# EAGLE design CWGenerator (EAGLE 8.6.0)
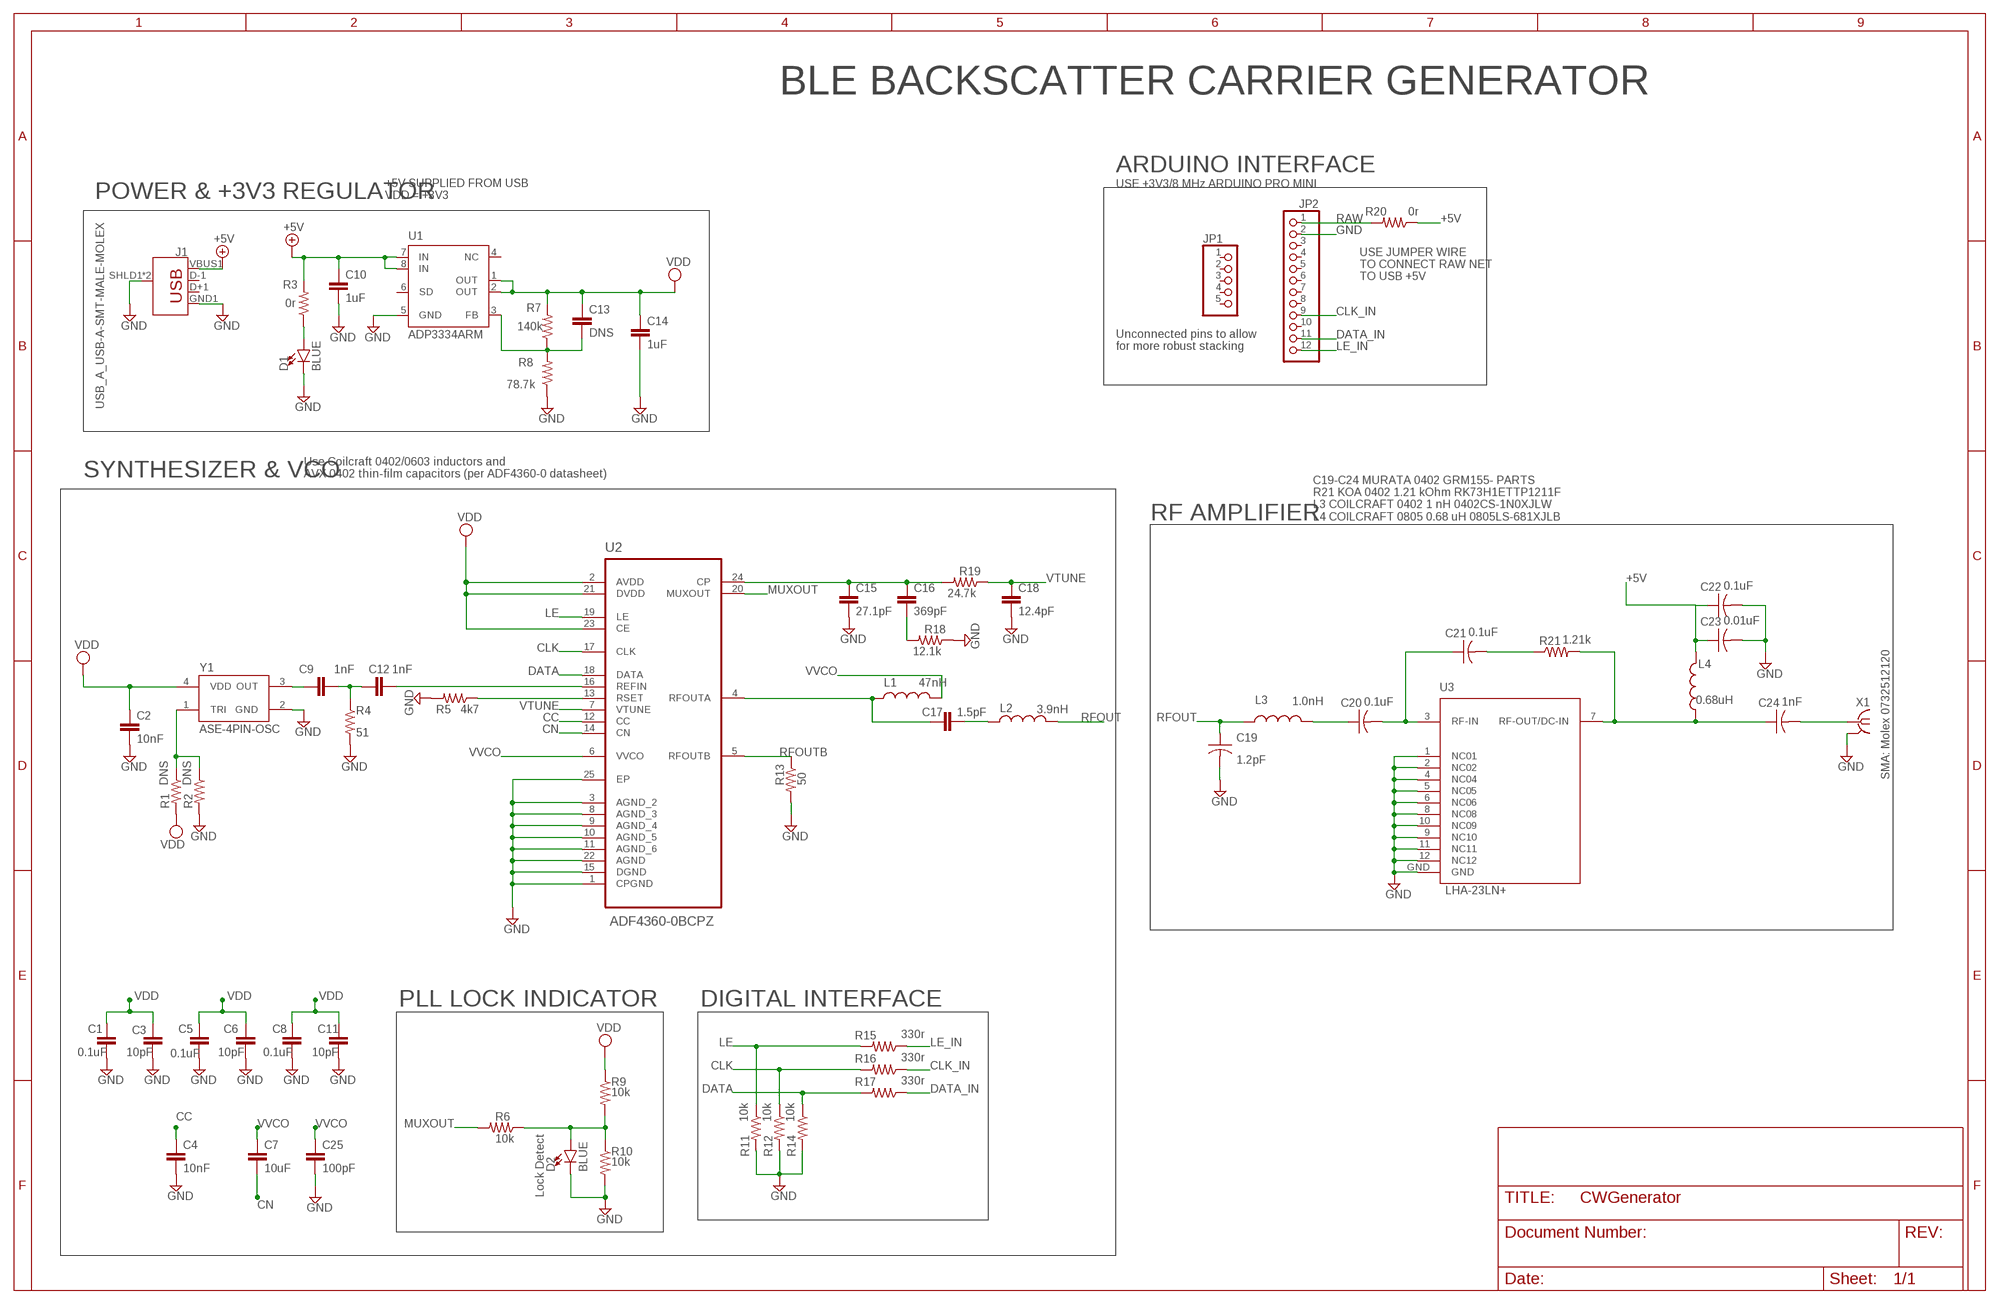
[diagram p0: schematic, sheet 1]

## Parts
C1  0.1uF  C-EUC0402  [C0402]
C2  10nF  C-EUC0402  [C0402]
C3  10pF  C-EUC0402  [C0402]
C4  10nF  C-EUC0402  [C0402]
C5  0.1uF  C-EUC0402  [C0402]
C6  10pF  C-EUC0402  [C0402]
C7  10uF  C-EUC0402  [C0402]
C8  0.1uF  C-EUC0402  [C0402]
C9  1nF  C-EUC0402  [C0402]
C10  1uF  C-EUC0402  [C0402]
C11  10pF  C-EUC0402  [C0402]
C12  1nF  C-EUC0402  [C0402]
C13  DNS  C-EUC0402  [C0402]
C14  1uF  C-EUC0402  [C0402]
C15  27.1pF  C-EUC0402  [C0402]
C16  369pF  C-EUC0402  [C0402]
C17  1.5pF  C-EUC0402  [C0402]
C18  12.4pF  C-EUC0402  [C0402]
C19  1.2pF  C-USC0402  [C0402]
C20  0.1uF  C-USC0402  [C0402]
C21  0.1uF  C-USC0402  [C0402]
C22  0.1uF  C-USC0402  [C0402]
C23  0.01uF  C-USC0402  [C0402]
C24  1nF  C-USC0402  [C0402]
C25  100pF  C-EUC0402  [C0402]
D1  BLUE  LED-BLUE0603  [LED-0603]
D2  BLUE  LED-BLUE0603  [LED-0603]
J1  USB_A_USB-A-SMT-MALE-MOLEX  [USB-A-SMT-MALE-MOLEX]
JP1  PINHD-1X5  [1X05]
JP2  PINHD-1X12  [1X12]
L1  47nH  L-USL0402  [C0402]
L2  3.9nH  L-USL0402  [C0402]
L3  1.0nH  L-USL0402  [C0402]
L4  0.68uH  L-USL0805  [R0805]
R1  DNS  R-US_R0402  [R0402]
R2  DNS  R-US_R0402  [R0402]
R3  0r  R-US_R0402  [R0402]
R4  51  R-US_R0402  [R0402]
R5  4k7  R-US_R0402  [R0402]
R6  10k  R-US_R0402  [R0402]
R7  140k  R-US_R0402  [R0402]
R8  78.7k  R-US_R0402  [R0402]
R9  10k  R-US_R0402  [R0402]
R10  10k  R-US_R0402  [R0402]
R11  10k  R-US_R0402  [R0402]
R12  10k  R-US_R0402  [R0402]
R13  50  R-US_R0402  [R0402]
R14  10k  R-US_R0402  [R0402]
R15  330r  R-US_R0402  [R0402]
R16  330r  R-US_R0402  [R0402]
R17  330r  R-US_R0402  [R0402]
R18  12.1k  R-US_R0402  [R0402]
R19  24.7k  R-US_R0402  [R0402]
R20  0r  R-US_R0402  [R0402]
R21  1.21k  R-US_R0402  [R0402]
U1  ADP3334ARM  [MSOP08]
U2  ADF4360-0BCPZ  [QFN50P400X400X100-25N]
U3  LHA-23LN+  [MCLP]
X1  SMA-142-0711-821/826  [J502-ND-142-0711-821/826]
Y1  ASE-4PIN-OSC  [3.2X2.5MM]

## Nets
+5V: C10.1 C22.1 C23.1 J1.VBUS1(VBUS) L4.2 R3.2 R20.1 U1.7(IN) U1.8(IN)
CC: C4.1 U2.12(CC)
CLK: R12.1 R16.2 U2.17(CLK)
CLK_IN: JP2.9 R16.1
CN: C7.2 U2.14(CN)
DATA: R14.1 R17.2 U2.18(DATA)
DATA_IN: JP2.11 R17.1
GND: C1.2 C2.2 C3.2 C4.2 C5.2 C6.2 C8.2 C10.2 C11.2 C14.2 C15.2 C18.2 C19.2 C22.2 C23.2 C25.2 D1.C D2.C J1.GND1(GND) J1.SHLD1(SHIELD) J1.SHLD2(SHIELD) JP2.2 R2.2 R4.2 R5.2 R8.1 R10.2 R11.2 R12.2 R13.2 R14.2 R18.1 U1.5(GND) U2.1(CPGND) U2.3(AGND_2) U2.8(AGND_3) U2.9(AGND_4) U2.10(AGND_5) U2.11(AGND_6) U2.15(DGND) U2.22(AGND) U2.25(EP) U3.1(NC01) U3.2(NC02) U3.4(NC04) U3.5(NC05) U3.6(NC06) U3.8(NC08) U3.9(NC10) U3.10(NC09) U3.11(NC11) U3.12(NC12) U3.GND X1.G@1 X1.G@2 X1.G@3 X1.G@4 Y1.2(GND)
LE: R11.1 R15.2 U2.19(LE)
LE_IN: JP2.12 R15.1
MUXOUT: R6.2 U2.20(MUXOUT)
N$1: D1.A R3.1
N$2: C20.1 L3.2
N$3: C20.2 C21.1 U3.3(RF-IN)
N$4: C21.2 R21.1
N$5: C24.1 L4.1 R21.2 U3.7(RF-OUT/DC-IN)
N$6: C13.2 R7.1 R8.2 U1.3(FB)
N$7: R5.1 U2.13(RSET)
N$10: C17.2 L2.1
N$12: C15.1 C16.1 R19.2 U2.24(CP)
N$13: C16.2 R18.2
N$15: C12.2 U2.16(REFIN)
N$17: C9.2 C12.1 R4.1
N$19: D2.A R6.1 R9.2 R10.1
N$20: C24.2 X1.1
N$23: C9.1 Y1.3(OUT)
N$24: R1.1 R2.1 Y1.1(TRI)
RAW: JP2.1 R20.2
RFOUT: C19.1 L2.2 L3.1
RFOUTA: C17.1 L1.1 U2.4(RFOUTA)
RFOUTB: R13.1 U2.5(RFOUTB)
VDD: C1.1 C2.1 C3.1 C5.1 C6.1 C8.1 C11.1 C13.1 C14.1 R1.2 R7.2 R9.1 U1.1(OUT) U1.2(OUT) U2.2(AVDD) U2.21(DVDD) U2.23(CE) Y1.4(VDD)
VTUNE: C18.1 R19.1 U2.7(VTUNE)
VVCO: C7.1 C25.1 L1.2 U2.6(VVCO)
Unconnected: J1.D+1(D+) J1.D-1(D-) JP1.1 JP1.2 JP1.3 JP1.4 JP1.5 JP2.3 JP2.4 JP2.5 JP2.6 JP2.7 JP2.8 JP2.10 U1.4(NC) U1.6(SD)

## Notes on the sheet
- BLE BACKSCATTER CARRIER GENERATOR
- ARDUINO INTERFACE
- USE +3V3/8 MHz ARDUINO PRO MINI
- POWER & +3V3 REGULATOR
- +5V SUPPLIED FROM USB
  VDD = +3V3
- USE JUMPER WIRE
  TO CONNECT RAW NET
  TO USB +5V
- Unconnected pins to allow
  for more robust stacking
- SYNTHESIZER & VCO
- Use Coilcraft 0402/0603 inductors and 
  AVX 0402 thin-film capacitors (per ADF4360-0 datasheet)
- RF AMPLIFIER
- C19-C24 MURATA 0402 GRM155- PARTS
  R21 KOA 0402 1.21 kOhm RK73H1ETTP1211F
  L3 COILCRAFT 0402 1 nH 0402CS-1N0XJLW
  L4 COILCRAFT 0805 0.68 uH 0805LS-681XJLB
- SMA: Molex 0732512120
- PLL LOCK INDICATOR | DIGITAL INTERFACE
- Lock Detect

## Library data of the parts
C1-C18 C25 = rcl:C-EU: CAPACITOR, European symbol; SPICEPREFIX: C
C19-C24 = rcl:C-US: CAPACITOR, American symbol; SPICEPREFIX: C
D1 D2 = SparkFun-LED:LED-BLUE: Blue SMD LED Used in manufacturing of various products at SparkFun Packages: 0603 - SMD 0603 package [Product Link] <http://www.digikey.com/product-detail/en/SMLE12BC7TT86/511-1589-2-ND/1641808> 1206 - SMD1206 package [Product Link] <http://www.digikey.com/product-detail/en/lite-on-inc/LTST-C150TBKT/160-1643-1-ND/573584> SparkFun Products: ESP8266 Thing-Dev Board <https://www.sparkfun.com/products/13711> RedBoard <https://www.sparkfun.com/products/12757>; PROD_ID: DIO-08575
J1 = SparkFun-Connectors:USB_A: USB-A Connector Male and female variants, as well as PTH and SMT variants SparkFun Products: SparkFun XBee Explorer Dongle <https://www.sparkfun.com/products/11697> PTH Male SparkFun MicroView-USB Programmer <https://www.sparkfun.com/products/12924> SMT Male SparkFun USB Type A Female Breakout <https://www.sparkfun.com/products/12700> SMT Female
JP1 = pinhead:PINHD-1X5: PIN HEADER
JP2 = pinhead:PINHD-1X12: PIN HEADER
L1-L4 = rcl:L-US: INDUCTOR, American symbol
R1-R21 = rcl:R-US_: RESISTOR, American symbol; SPICEPREFIX: R
U1 = analog-devices:ADP3334: http://www.analog.com/media/en/technical-documentation/data-sheets/ADP3334.pdf
U2 = ADI-Phase-2:ADF4360-0BCPZ: Integrated Synthesizer and VCO; MPN: ADF4360-0BCPZ; OC_FARNELL: unknown; OC_NEWARK: 59K1097; PACKAGE: LFCSP-24; SUPPLIER: Analog Devices
U3 = minicircuits:LHA-23LN+: Description: Wideband amplifier 30 MHz to 2 GHz https://www.minicircuits.com/pdfs/LHA-23LN+.pdf
X1 = con-coax:SMA-: SMA 50 Ohm End Launch Jack Receptacle - Round Contact Johnson Components Source: www.johnsoncomponents.com .. J502-ND.pdf; MF: JOHNSON COMPONENTS; MPN: 142-0711-821; OC_FARNELL: 1019328; OC_NEWARK: 16F3627
Y1 = abracon:ASE-4PIN-OSC

## Board
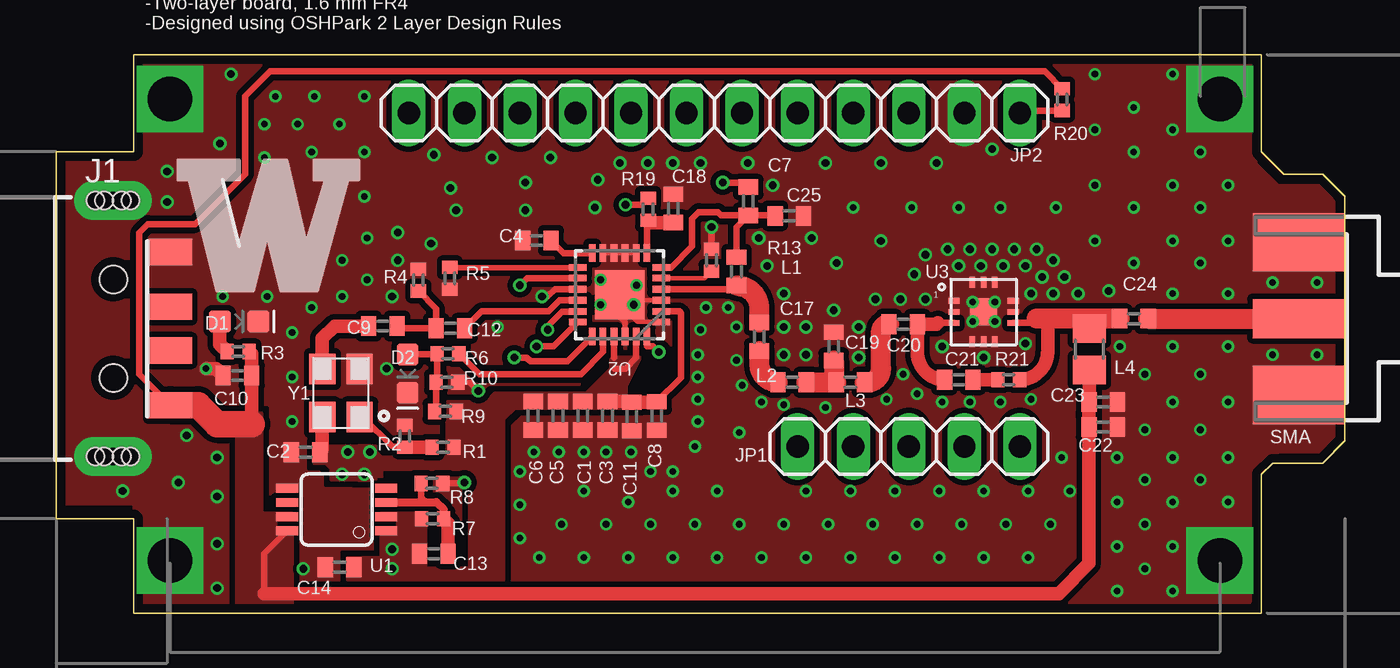
[diagram p1: board, top side]
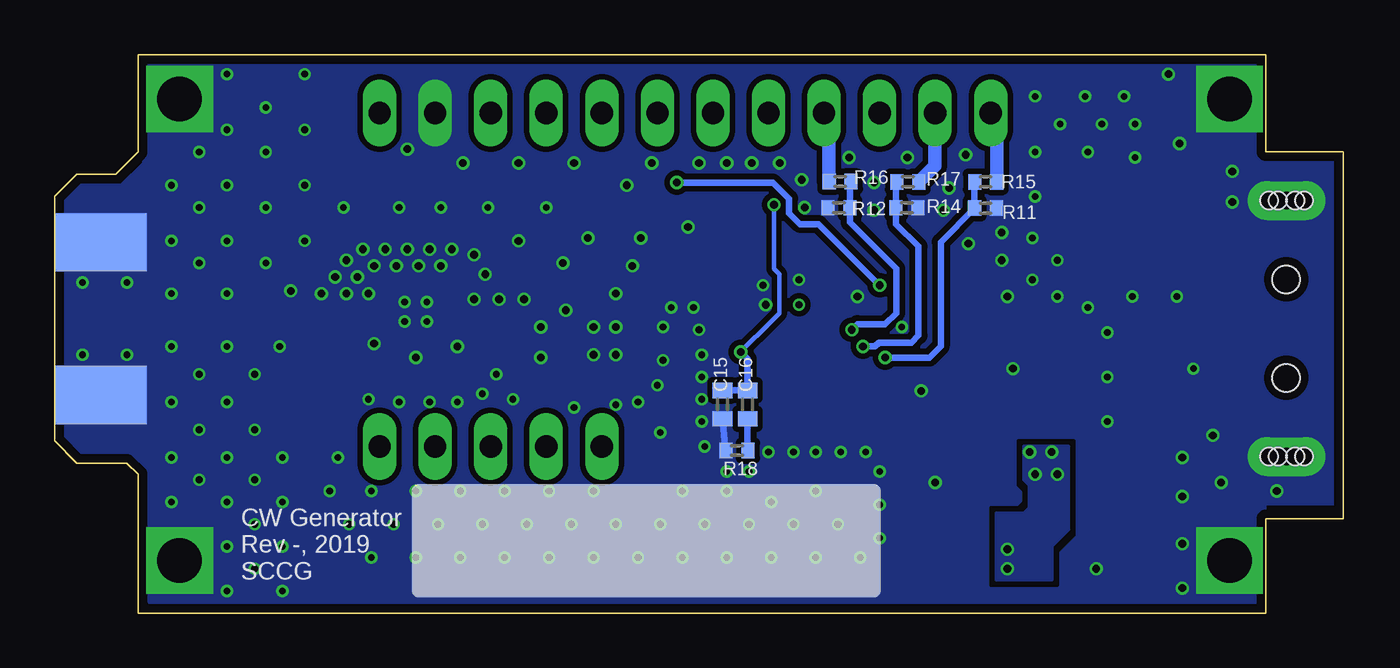
[diagram p2: board, bottom side, seen from below]

Size 58.93 x 25.53 mm. Coordinates in mm from the lower left corner, seen from the top.
Outline: 55.12,25.53 3.56,25.53 3.56,21.08 0,21.08 0,4.32 3.56,4.32 3.56,0 55.12,0 55.12,6.35 55.63,6.86 57.91,6.86 58.93,7.87 58.93,19.05 57.91,20.07 56.13,20.07 55.12,21.08 55.12,25.53
Copper layers (1*16): Top 0.035559375mm / dielectric 1.6mm / Bottom 0.035559375mm
Design rules "oshpark2layer *": minimum track width 6mil, minimum drill 10mil, track to track 6mil, track to pad 6mil, pad to pad 6mil, via to via 6mil, smd to smd 6mil, copper to edge 15mil, drill to drill 6mil, minimum pad ring 5mil, minimum via ring 5mil, stop-mask expansion 2.5mil, vias tented up to drill 18mil, thermal gap 10mil

### Footprints (pad centres in the part's own frame; a part is rotated, then mirrored left to right if it is on the bottom)
C0402 = smd 0.7 x 0.9: 1 -0.65,0; 2 0.65,0
LED-0603 = smd 1 x 1: A -0.877,0; C 0.877,0
USB-A-SMT-MALE-MOLEX = smd 2 x 1.2: D+1 5.35,1; D-1 5.35,-1; GND1 5.35,3.5; VBUS1 5.35,-3.5 | drill 0.8 pad 1.778 long: SHLD1 2.73,-5.85; SHLD2 2.73,5.85 | hole 1.25: 2.75,2.25; 2.75,-2.25 | hole 0.8: 3.13,-5.85; 3.53,-5.85; 2.33,-5.85; 1.93,-5.85; 3.13,5.85; 3.53,5.85; 2.33,5.85; 1.93,5.85
1X05 = drill 1.016 long: 1 -5.08,0; 2 -2.54,0; 3 0,0; 4 2.54,0; 5 5.08,0
1X12 = drill 1.016 long: 1 -13.97,0; 2 -11.43,0; 3 -8.89,0; 4 -6.35,0; 5 -3.81,0; 6 -1.27,0; 7 1.27,0; 8 3.81,0; 9 6.35,0; 10 8.89,0; 11 11.43,0; 12 13.97,0
R0805 = smd 1.3 x 1.5: 1 -0.95,0; 2 0.95,0
R0402 = smd 0.6 x 0.7: 1 -0.5,0; 2 0.5,0
MSOP08 = smd 0.4 x 1: 1 -0.976,-2.263; 2 -0.326,-2.263; 3 0.324,-2.263; 4 0.974,-2.263; 5 0.974,2.262; 6 0.324,2.262; 7 -0.326,2.262; 8 -0.976,2.262
QFN50P400X400X100-25N = smd 0.813 x 0.305: 1 -1.905,1.245; 2 -1.905,0.762; 3 -1.905,0.254; 4 -1.905,-0.254; 5 -1.905,-0.762; 6 -1.905,-1.245; 13 1.905,-1.245; 14 1.905,-0.762; 15 1.905,-0.254; 16 1.905,0.254; 17 1.905,0.762; 18 1.905,1.245 | smd 0.305 x 0.813: 7 -1.245,-1.905; 8 -0.762,-1.905; 9 -0.254,-1.905; 10 0.254,-1.905; 11 0.762,-1.905; 12 1.245,-1.905; 19 1.245,1.905; 20 0.762,1.905; 21 0.254,1.905; 22 -0.254,1.905; 23 -0.762,1.905; 24 -1.245,1.905 | smd 2.261 x 2.261: 25 0,0
MCLP = smd 0.508 x 0.254: 1 -1.359,0.508; 2 -1.359,0; 3 -1.359,-0.508; 7 1.359,-0.508; 8 1.359,0; 9 1.359,0.508 | smd 0.254 x 0.508: 4 -0.508,-1.359; 5 0,-1.359; 6 0.508,-1.359; 10 0.508,1.359; 11 0,1.359; 12 -0.508,1.359 | smd 1.245 x 1.245: GND 0,0
J502-ND-142-0711-821/826 = smd 4.191 x 1.778: 1 2.115,0 | smd 4.191 x 2.667: G@1 2.115,3.495; G@2 2.115,-3.495 | smd 4.191 x 2.667 bottom: G@3 2.115,3.495; G@4 2.115,-3.495
3.2X2.5MM = smd 1.4 x 1.2: 1 -1.1,-0.85; 2 1.1,-0.85; 3 1.1,0.85; 4 -1.1,0.85

### Placement (x,y rotation side)
C1  24.08,9.03 270 top
C2  11.41,7.35 180 top
C3  25.22,9.03 270 top
C4  21.98,17.03 180 top
C5  22.95,9.03 270 top
C6  21.82,9.03 270 top
C7  31.65,18.83 90 top
C8  27.47,9.01 270 top
C9  14.95,13.12 0 top
C10  8.29,10.87 180 top
C11  26.33,8.99 270 top
C12  18.02,13.02 0 top
C13  17.27,2.72 0 top
C14  12.96,2.1 180 top
C15  28.39,9.53 270 bottom
C16  27.24,9.53 270 bottom
C17  32.15,12.63 270 top
C18  28.23,18.5 90 top
C19  35.56,12.19 90 top
C20  38.73,13.21 0 top
C21  41.27,10.67 0 top
C22  47.88,8.51 0 top
C23  47.88,9.65 0 top
C24  49.28,13.46 0 top
C25  33.53,18.16 0 top
D1  8.37,13.33 0 top
D2  16.08,10.95 270 top
J1  -0.13,13.01 0 top
JP1  38.99,7.62 0 top
JP2  30.1,22.86 180 top
L1  31.11,15.62 90 top
L2  33.66,10.55 0 top
L3  36.32,10.55 0 top
L4  47.24,12.07 270 top
R1  17.7,7.58 0 top
R2  15.95,8.09 90 top
R3  8.33,11.96 0 top
R4  16.57,15.23 90 top
R5  18,15.3 270 top
R6  17.92,11.86 0 top
R7  17.21,4.32 180 top
R8  17.18,5.93 180 top
R9  17.8,9.22 180 top
R10  17.87,10.56 0 top
R11  16.36,18.51 0 bottom
R12  23.07,18.53 180 bottom
R13  29.97,16.13 90 top
R14  19.95,18.53 0 bottom
R15  16.36,19.71 180 bottom
R16  23.02,19.73 0 bottom
R17  19.91,19.71 180 bottom
R18  27.73,7.44 0 bottom
R19  27.07,18.47 90 top
R20  46,23.48 270 top
R21  43.56,10.67 0 top
U1  12.82,4.74 90 top
U2  25.77,14.55 180 top
U3  42.41,13.77 0 top
X1  58.93,13.46 180 top
Y1  13.03,10.06 90 top

### Tracks (layer width: path | path; a pad name or v marks a point on that pad's centre or on a via)
+5V
  Top 0.305: R20.1 45.21,24.77 9.78,24.77 8.64,23.62 8.64,20.07 6.35,17.78 4.19,17.78 3.81,17.4 3.81,10.92 J1.VBUS1 | 8.94,8.64 8.94,8.43 8.89,8.38 | 9.53,0.89 9.53,2.73 U1.8
  Top 0.61: C22.1 arc-90 47.24,8.49 C22.1 | R3.2 8.94,11.85 C10.1 8.94,8.64 | L4.2 47.24,9.67 C23.1 C22.1 | C22.1 47.23,2.27 45.85,0.89 9.53,0.89
  Top 1.219: J1.VBUS1 6.49,9.51 7.37,8.64 8.94,8.64
  pour Top (no thermals): 10.79,4.57 9.4,4.57 9.4,9.14 8.26,9.14 8.26,0.25 10.79,0.25 10.79,3.81 10.03,3.81 10.03,4.32 10.79,4.32
CC
  Top 0.305: C4.1 23.21,16.46 U2.12
CLK  (via drill 0.35)
  Top 0.305: U2.17 23.84,13.77 23.13,13.77 22.48,13.12 v22.48,12.95
  Bottom 0.305: R16.2 22.57,19.68 R12.1 22.57,17.87 20.45,15.75 20.45,13.72 20.95,13.21 22.23,13.21 v22.48,12.95
CLK_IN
  Bottom 0.305: 23.46,19.78 R16.1
  Bottom 0.61: R16.1 23.52,22.63 JP2.9
CN  (via drill 0.35)
  Top 0.305: v21.21,14.99 21.54,15.32 U2.14 | v30.48,19.69 31.44,19.69 C7.2
  Bottom 0.305: v21.21,14.99 24,17.78 24.84,17.78 25.35,18.29 25.35,18.95 26.09,19.69 v30.48,19.69
DATA  (via drill 0.35)
  Top 0.305: U2.18 22.74,12.19 v21.97,12.19
  Bottom 0.305: R17.2 20.45,19.67 R14.1 20.45,17.79 19.43,16.76 19.43,12.7 19.76,12.37 21.24,12.37 21.41,12.19 v21.97,12.19
DATA_IN
  Bottom 0.61: JP2.11 18.67,20.46 R17.1
GND  (via drill 0.3, 0.3 pad 0.48, 0.35, 2.03)
  Top 0.203: U2.8 U2.9 U2.10 U2.11 | U2.3 26.62,14.3 v26.42,14.1 | U2.1 26.58,13.31 25.77,14.12
  Top 0.254: U2.22 26.02,13.31 25.76,13.57 25.76,14.12 | R10.2 18.91,10.56 v19.3,10.16
  Top 0.305: U2.15 22.81,14.81 22.48,14.48 v22.23,14.48 | v29.97,17.65 R13.2 | 25.76,14.12 25.77,14.12 U2.25 arc90 25.08,15.24 v24.89,15.24 | R8.1 18.63,5.93 v18.67,5.97
  Top 0.61: v6.86,11.18 7.32,11.18 7.34,11.15 7.35,11.15 C10.2
  Top 0.914: U2.25 arc90 26.22,14.1 v26.42,14.1
  Bottom 0.305: R18.1 28.14,7.52 28.27,7.65 C15.2
  other vias: 15.11,11.18 18.29,18.41 24.64,18.54 35.56,13.84 43.81,16.64 41.27,15.88 42.29,15.88 43.31,15.88 40.77,16.64 41.78,16.64 42.8,16.64 42.93,13.34 41.91,13.34 41.91,14.22 42.93,14.22 29.21,7.62 29.34,8.76 29.34,9.78 29.34,10.8 29.34,11.81 29.46,12.95 29.72,13.97 30.73,13.97 31.11,13.08 31.11,11.56 31.37,10.41 33.27,9.53 35.18,9.4 37.97,9.78 38.73,10.92 39.37,10.03 40.51,9.65 43.18,9.65 44.58,9.78 32.51,15.88 33.27,14.61 37.47,14.35 33.27,13.08 33.27,11.81 34.29,11.81 36.7,11.68 36.7,13.08 38.61,14.35 46.74,14.61 45.59,14.61 44.58,14.61 48.13,14.73 21.21,6.48 22.99,7.37 25.15,7.37 26.29,7.37 24.13,7.37 21.84,7.37 28.19,6.48 27.18,6.48 32.13,17.14 32.77,19.56 31.62,20.57 29.46,20.57 28.19,20.57 27.05,20.57 25.78,20.57 24.77,19.81 21.46,18.41 21.46,19.69 19.94,20.83 22.61,20.83 18.03,19.43 17.27,20.95 15.62,17.4 17.14,16.89 15.62,16.13 15.37,14.48 21.21,4.95 21.21,3.43 10.79,8.76 10.79,10.8 11.3,2.03 10.79,12.83 35.18,20.57 37.72,20.57 40.26,20.57 42.8,21.21 40.39,5.59 42.42,5.59 44.45,5.59 31.24,8.26 20.19,13.08 26.54,14.99 14.1,21.08 14.1,19.05 14.22,15.24 13.08,14.48 34.29,13.08 41.78,9.65 32.26,9.65 45.09,15.37 46.1,15.37 44.32,15.88 44.83,16.64 45.59,16.13 39.75,16.38 39.24,15.49 39.75,14.35 46.35,5.59 38.35,5.59 36.32,5.59 34.29,5.59 35.31,4.06 45.47,4.06 37.34,4.06 39.37,4.06 41.4,4.06 43.43,4.06 44.45,2.54 42.42,2.54 40.39,2.54 38.35,2.54 36.32,2.54 34.29,2.54 33.27,4.06 31.24,4.06 32.26,2.54 30.23,2.54 14.1,23.62 5.08,20.19 5.08,18.8 3.05,5.59 28.19,2.54 26.16,2.54 24.13,2.54 30.23,5.59 24.13,5.59 26.16,5.08 28.19,5.59 27.18,4.06 29.21,4.06 25.15,4.06 23.11,4.06 22.1,2.54 45.97,7.11 48.51,7.11 51.05,7.11 49.78,8.38 48.51,1.02 51.05,1.02 48.51,3.05 51.05,3.05 48.51,5.08 51.05,5.08 40.51,12.19 44.32,12.32 48.64,12.19 42.42,11.68 13.08,16.13 14.22,17.14 7.62,14.48 9.65,14.48 11.68,13.97 5.21,23.5 5.21,2.41 53.21,23.5 53.21,2.41 49.78,6.1 49.78,4.06 49.78,2.03 51.05,9.65 51.05,12.19 49.78,10.92 52.32,10.92 53.59,9.65 53.59,12.19 53.59,7.11 53.59,5.08 52.32,8.38 52.32,6.1 55.63,11.81 57.66,11.81 57.66,15.11 55.63,15.11 53.59,14.61 51.05,14.61 52.32,16 52.32,18.54 52.32,21.08 53.59,17.02 53.59,19.56 51.05,19.56 51.05,17.02 49.28,16 49.28,18.54 49.28,21.08 49.28,23.11 51.05,22.1 51.05,24.64 47.5,24.64 47.5,22.1 47.5,19.56 47.5,17.02 45.72,18.54 43.18,18.54 41.27,18.54 39.12,18.54 36.45,18.54 37.72,17.02 35.69,16 34.54,17.14 12.95,22.35 9.53,22.35 10.03,23.62 9.53,20.83 11.81,23.62 11.05,22.35 11.68,21.08 7.37,5.33 7.37,7.11 7.37,1.14 7.37,3.18 5.97,8.13 5.59,5.97 7.49,21.46 8,24.64
  pour Bottom (isolate 0.254, rank 2, no thermals): 3.68,25.15 50.93,25.15 50.8,0.25 3.56,0.25
  pour Top (isolate 0.254, rank 2, no thermals): 3.68,25.15 50.93,25.15 50.93,0.13 3.56,0.25
  pour Top (isolate 0.254, no thermals): 5.46,20.83 0.38,20.83 0.38,5.08 5.46,5.08
  pour Bottom (isolate 0.254, no thermals): 5.46,20.83 0.38,20.83 0.38,5.08 5.46,5.08
  pour Top (isolate 0.254, no thermals): 50.8,25.15 54.74,25.15 54.86,25.02 54.86,20.57 55.88,19.56 57.91,19.56 58.67,18.41 58.67,8.26 57.91,7.37 55.88,7.37 54.86,6.35 54.86,0.76 54.36,0.25 50.8,0.25
  pour Bottom (isolate 0.254, no thermals): 50.8,25.15 54.74,25.15 54.86,25.02 54.86,20.57 55.88,19.56 57.91,19.56 58.93,18.54 58.93,8.38 57.91,7.37 55.88,7.37 54.86,6.35 54.86,0.76 54.36,0.25 50.8,0.25
LE  (via drill 0.35)
  Top 0.305: v20.95,11.68 21.51,11.68 21.69,11.51 23.38,11.51 U2.19
  Bottom 0.305: v20.95,11.68 18.92,11.68 18.41,12.19 18.41,16.96 R11.1 R15.2
LE_IN
  Bottom 0.305: 15.85,19.72 R15.1
  Bottom 0.61: R15.1 15.86,22.59 JP2.12
MUXOUT
  Top 0.305: U2.20 25,11.95 25.02,11.94 24,10.92 19.36,10.92 R6.2
N$1
  Top 0.61: R3.1 7.49,12.3 D1.A
N$2
  Top 0.914: L3.2 37.09,10.55 arc90 37.72,11.18 37.72,12.84 arc-90 C20.1
N$3
  Top 0.305: U3.3 40.31,13.26
  Top 0.61: 40.31,13.26 40.26,13.21 C20.2 39.38,11.91 arc90 C21.1
N$4
  Top 0.61: C21.2 R21.1
N$5
  Top 0.305: U3.7 45.14,13.26 45.34,13.46 | L4.1 47.24,13.46
  Top 0.61: R21.2 arc90 45.34,11.95 45.34,13.46
  Top 0.914: C24.1 47.24,13.46 45.34,13.46 44.83,13.46
N$6
  Top 0.305: R8.2 16.68,5.29 16.89,5.08
  Top 0.356: U1.3 15.1,5.08 16.89,5.08 17.4,5.08 17.71,4.77 R7.1
  Top 0.61: R7.1 17.92,4.11 C13.2
N$7
  Top 0.254: U2.13 R5.1
N$8  (via drill 0.3)
  other vias: 24.89,14.1
N$10
  Top 0.914: C17.2 32.15,11.42 arc90 L2.1
N$12  (via drill 0.35)
  Top 0.305: U2.24 27.01,12.19 27.3,12.19 v27.56,11.94 | R19.2 26.77,18.67 v26.04,18.67
  Bottom 0.203: v26.04,18.67 26.04,15.75 25.78,15.5 25.78,13.71 26.15,13.34 26.16,13.34 v27.56,11.94
  Bottom 0.305: v27.56,11.94 27.24,11.62 C16.1 C15.1
N$13
  Bottom 0.305: C16.2 27.24,7.45 R18.2
N$15
  Top 0.305: U2.16 23.01,14.3 22.51,13.79 19.45,13.79 C12.2
N$17
  Top 0.305: C9.2 15.7,13.02 C12.1 17.38,13.92 R4.1
N$19
  Top 0.305: D2.A 17.39,11.83 R6.1 17.42,10.61 R10.1 17.37,9.29 R9.2
N$20
  Top 0.914: C24.2 X1.1
N$23
  Top 0.61: C9.1 12.74,13.12 12.18,12.56 Y1.3
N$24
  Top 0.254: R2.1 15.92,7.62 15.37,7.62 14.03,8.96 Y1.1
  Top 0.61: R1.1 15.96,7.58 R2.1
RAW
  Top 0.305: JP2.1 44.19,22.98 R20.2
RFOUT
  Top 0.914: L2.2 L3.1 35.56,10.66 C19.1
RFOUTA
  Top 0.305: U2.4 30.95,14.81 L1.1
  Top 0.914: L1.1 arc-90 32.15,13.94 C17.1
RFOUTB
  Top 0.203: R13.1 29.66,15.32 U2.5
VDD  (via drill 0.35)
  Top 0.305: U2.21 25.51,11.68 | 27.7,13.77 U2.2 28.5,13.79 28.57,13.72 28.57,10.77 C8.1 | 25.53,11.18 26.04,11.18 26.53,11.67 U2.23
  Top 0.61: Y1.4 12.18,7.46 C2.1 | C3.1 26.29,9.68 C11.1 27.45,9.64 C8.1
  other vias: 15.37,2.92 15.37,2.03 13.34,7.37 14.35,7.37 14.1,6.35 13.08,6.35
  pour Top (no thermals): 13.34,1.52 13.34,2.54 14.86,2.54 14.86,3.81 15.62,3.81 15.62,4.32 14.86,4.32 14.86,4.57 16.89,4.57 16.89,1.52
  pour Top (no thermals): 11.81,7.62 14.61,7.62 14.61,6.1 12.57,6.1 12.57,6.6 12.32,6.86 11.81,6.86
  pour Bottom (no thermals): 15.88,4.57 15.88,1.52 13.34,1.52 13.34,3.05 12.57,3.81 12.57,7.62 14.61,7.62 14.61,6.1 14.35,5.84 14.35,4.83 14.61,4.57
  pour Top (isolate 0.254, no thermals): 16.89,1.52 20.45,1.52 20.45,8.89 20.95,9.4 25.78,9.4 26.04,9.65 26.04,10.41 26.67,11.68 25.4,11.68 25.4,11.18 24.26,10.03 20.07,10.03 19.68,9.65 17.91,9.65 17.91,7.11 14.86,7.11 14.35,7.62 13.84,7.62 13.84,6.1 14.86,6.1 14.86,6.6 18.92,6.6 18.92,2.03 16.89,2.03
VTUNE
  Top 0.305: R19.1 27.01,17.91 U2.7
  Top 0.61: R19.1 27.19,17.85 C18.1
VVCO
  Top 0.305: U2.6 28.12,15.8 29.08,16.76 29.08,18.03 29.39,18.34 30.25,18.34 30.41,18.18 C7.1 | C7.1 31.62,18.15 | C7.1 31.11,17.64 L1.2 | C7.1 32.88,18.18 C25.1

### Text on the board
tPlace: NOTES: | -Dimensions are designed to fit a Hammong 1551USB3 plastic case / -Two-layer board, 1.6 mm FR4 / -Designed using OSHPark 2 Layer Design Rules | SMA | DIMENSIONS IN INCHES
bPlace: CW Generator / Rev -, 2019 / SCCG